# Altium schematic sheet 06_POWER.SchDoc
size A3
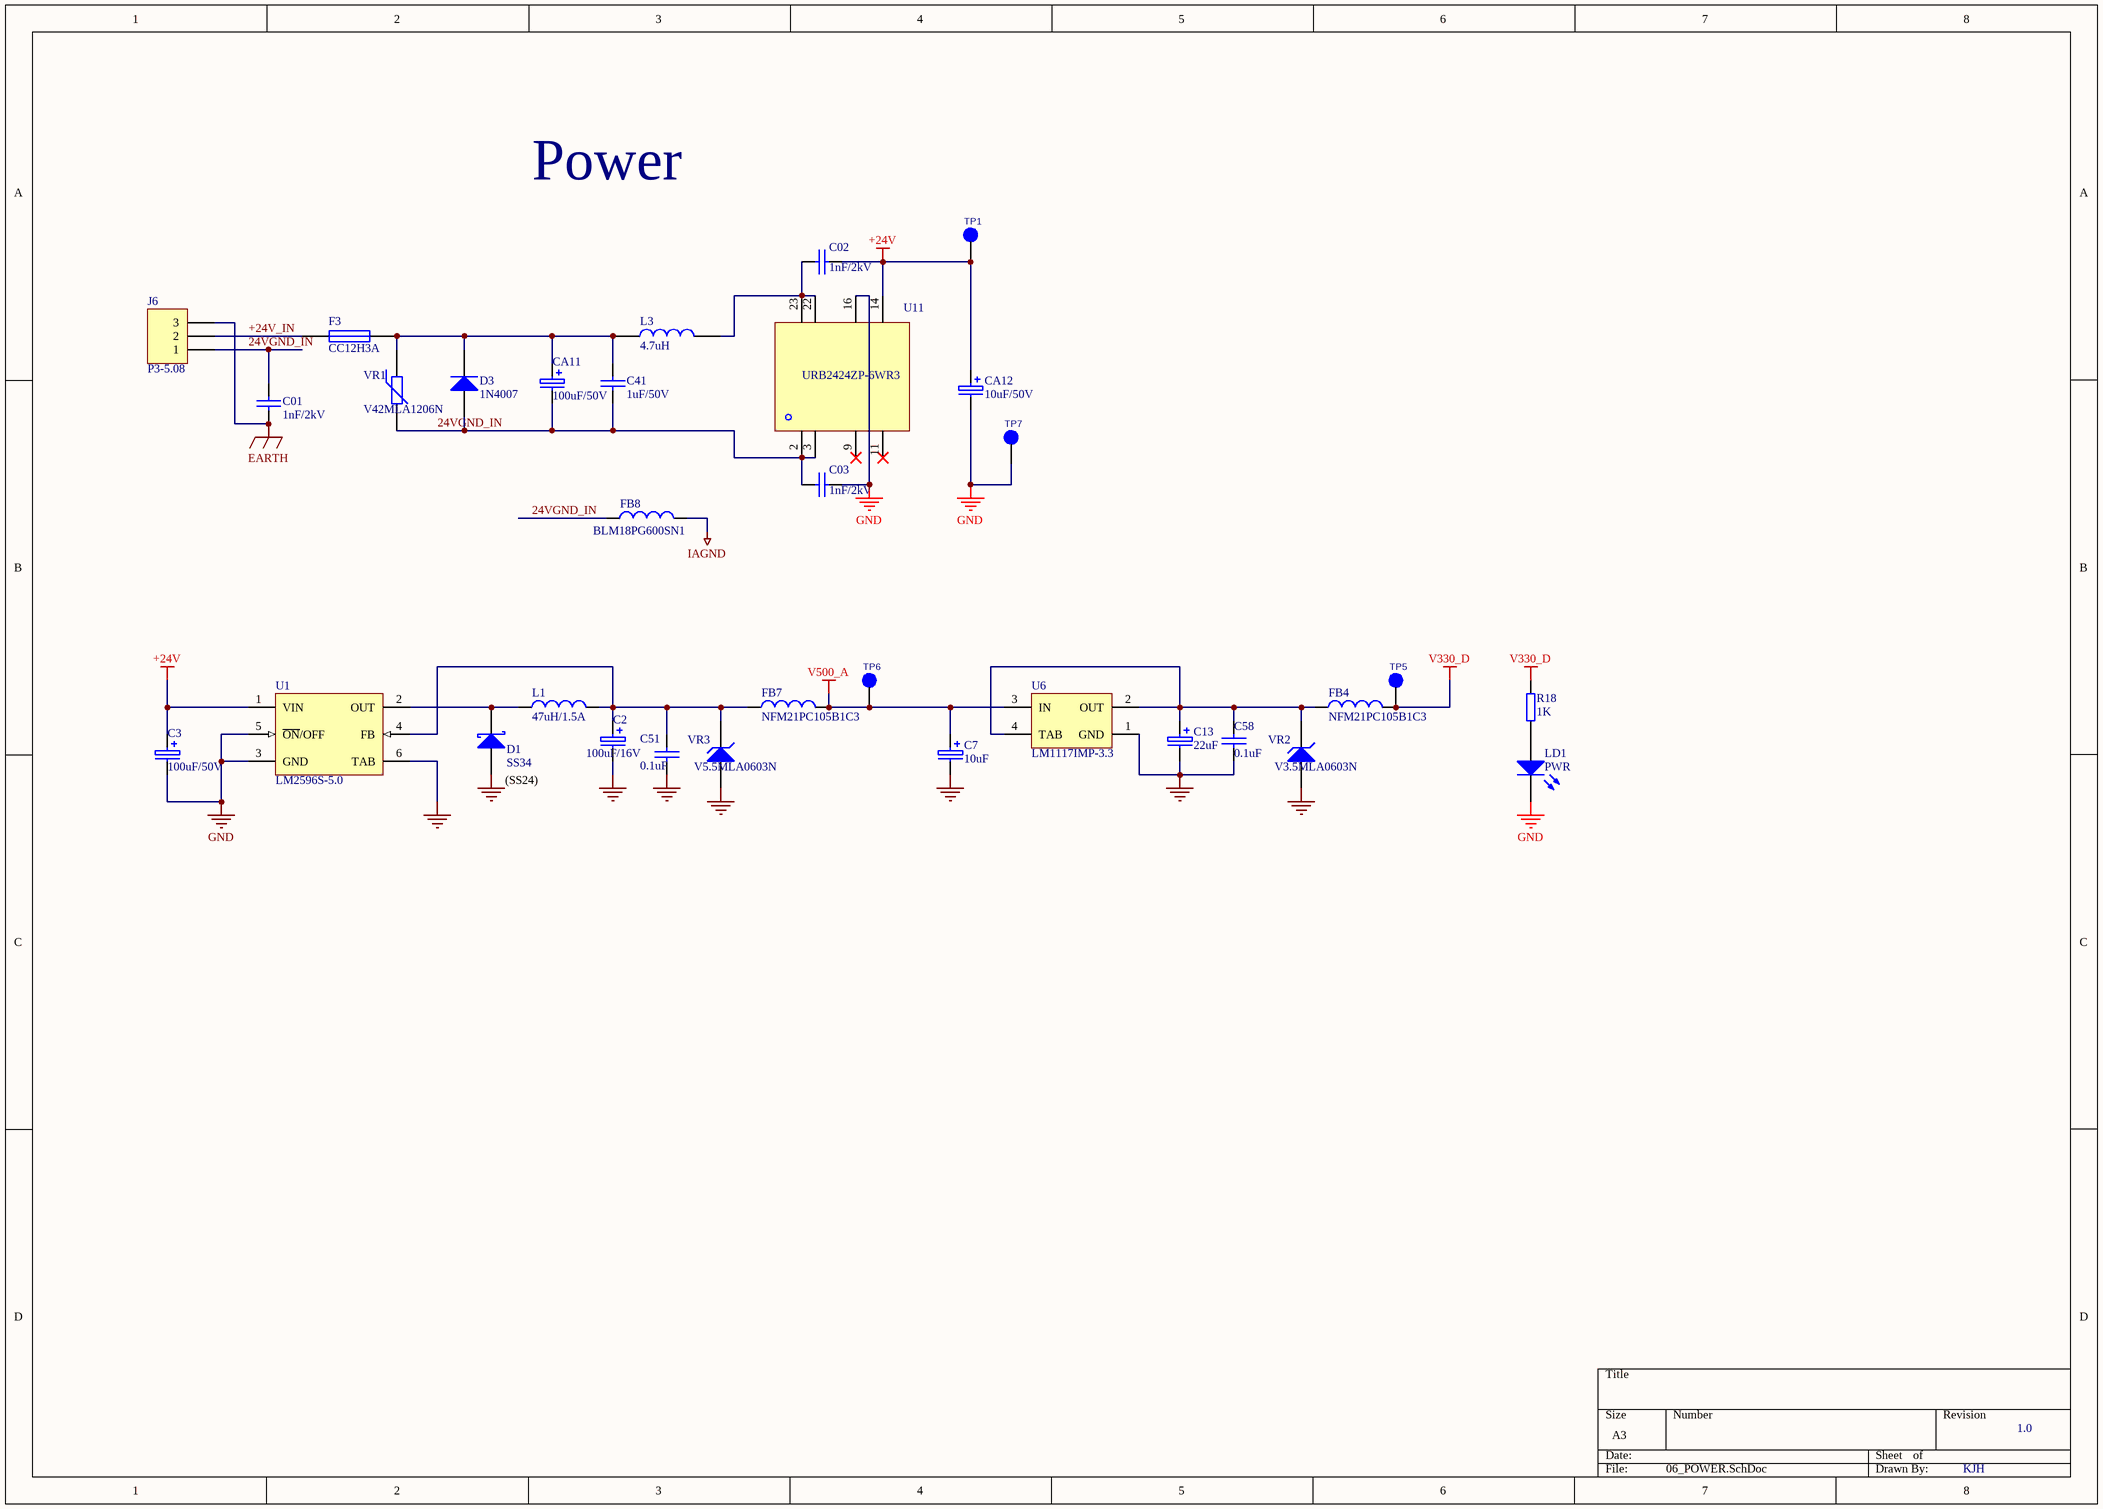
[diagram p0: 06_POWER.SchDoc]

## Parts
C01  1nF/2kV  [1206]
C02  1nF/2kV  [1206]
C2  100uF/16V  [D]
C03  1nF/2kV  [1206]
C3  100uF/50V  [D]
C7  10uF  [1206C]
C13  22uF  [1206C]
C41  1uF/50V  [0805]
C51  0.1uF  [0603A]
C58  0.1uF  [0603]
CA11  100uF/50V  [D]
CA12  10uF/50V  [1206C]
D1  SS34  [ZD]
D3  1N4007  [1N4007]
F3  CC12H3A  [1812]
FB4  NFM21PC105B1C3  [NFM21PC105]
FB7  NFM21PC105B1C3  [NFM21PC105]
FB8  BLM18PG600SN1  [0603]
J6  P3-5.08  [PH3-5.08mm]
L1  47uH/1.5A  [1812]
L3  4.7uH  [LPS3010]
LD1  PWR  [LED]
R18  1K  [0603A]
TP1  P24V  [test point]  (value not drawn)
TP5  P3.3V  [test point]  (value not drawn)
TP6  P5V  [test point]  (value not drawn)
TP7  GND  [test point]  (value not drawn)
U1  LM2596S-5.0  [TS5B_N]
U6  LM1117IMP-3.3  [MP04A_N]
U11  URB2424ZP-6WR3  [URB2424ZP-6WR3]
VR1  V42MLA1206N  [1206]
VR2  V3.5MLA0603N  [0603]
VR3  V5.5MLA0603N  [0603]

## Nets
+24V: C02.1 C3.1 CA12.1 TP1.1 U1.1(VIN) U11.14
EARTH: C01.2 J6.3
GND: C2.2 C03.1 C3.2 C7.2 C13.2 C51.2 C58.2 CA12.2 D1.1(A) LD1.2(K) TP7.1 U1.3(GND) U1.5(~{ON}/OFF) U1.6(TAB) U6.1(GND) U11.16 VR2.1(A) VR3.1(A)
IAGND: FB8.2
V330_D: FB4.2 R18.2 TP5.1
V500_A: C7.1 FB7.2 TP6.1 U6.3(IN)
24VGND_IN: C01.1 C03.2 C41.2 CA11.2 D3.1(A) FB8.1 J6.1 U11.2 U11.3 VR1.2
+24V_IN: F3.1 J6.2
NetC2_1: C2.1 C51.1 FB7.1 L1.2 U1.4(FB) VR3.2(K)
NetC02_2: C02.2 L3.2 U11.22 U11.23
NetC13_1: C13.1 C58.1 FB4.1 U6.2(OUT) U6.4(TAB) VR2.2(K)
NetC41_1: C41.1 CA11.1 D3.2(K) F3.2 L3.1 VR1.1
NetD1_2: D1.2(K) L1.1 U1.2(OUT)
NetLD1_1: LD1.1(A) R18.1

Not connected (* = marked no-connect by the designer): U11 9* 11*

## Notes on the sheet
- Power
- (near D1) (SS24)
- 1.0
- KJH

## Library data of the parts
C01 C02 C03 C41 C51 C58 = CAP: Capacitor
C2 C3 CA11 CA12 = CAPE: 极性电容
C7 C13 = C: 极性电容
D1 = D Schottky: Schottky Diode; Published: 8-Jun-2000; LatestRevisionDate: 17-Jul-2002; LatestRevisionNote: Re-released for DXP Platform.; PackageReference: SMB; Publisher: Altium Limited; PackageDescription: DO-214-AA/SMB; 2 C-Bend Leads; Body 5.3 x 3.6 mm, inc. leads (LxW); Code_JEDEC: DO-214-AA
D3 = Diode 1N4007: 1 Amp General Purpose Rectifier; Published: 8-Jun-2000; LatestRevisionDate: 17-Jul-2002; LatestRevisionNote: Re-released for DXP Platform.; DatasheetVersion: 1998; PackageVersion: Aug-1999; PackageReference: DO-41; Publisher: Altium Limited; PackageDescription: Diode, Axial; Body 5.2 x 2.7 mm (LxDia. max), Lead Dia. 0.86 mm (max); Code_JEDEC: DO-204-AL; ComponentLink1Description: Manufacturer Link; ComponentLink1URL: http://www.fairchildsemi.com/; ComponentLink2Description: Datasheet; ComponentLink2URL: http://www.fairchildsemi.com/ds/1N%2F1N4001.pdf
F3 = FUSE1: Fuse, 3A, 63Vdc
FB4 FB7 FB8 L1 = Inductor: Code_IEC: 1005; Value: 10mH; Published: 8-Jun-2000; LatestRevisionDate: 29-May-2009; LatestRevisionNote: IPC-7351 Footprint Added.; PackageReference: 0402-A; Publisher: Altium Limited; PackageDescription: Chip Inductor; Code_JEITA: 0402
J6 = Header 3: Header, 3-Pin; LatestRevisionDate: 17-Jul-2002; LatestRevisionNote: Re-released for DXP Platform.; Publisher: Altium Limited
L3 = INDUCTOR
LD1 = LED0: Typical INFRARED GaAs LED; Published: 8-Jun-2000; LatestRevisionDate: 08-Jul-2005; LatestRevisionNote: Mech Layer 1 removed.; PackageReference: LED-0; Publisher: Altium Limited; PackageDescription: LED; 2 Leads
R18 = RE: 电阻
TP1 TP5-TP7 = PAD
U1 = LM2596S-5.0: SIMPLE SWITCHER?Power Converter 150 KHz 3A Step-Down Voltage Regulator, 5-pin TO-263; Manufacturer: National Semiconductor; PackageTopMarking: NSUZXYTTE#*LM2596S*-5.0 P+; PowerWise: N; Published: 4-Dec-2008; DatasheetVersion: May-2002; PackageVersion: revD, Apr-2005; PackageReference: TS5B; Publisher: Altium Limited; PackageDescription: TO-263, Molded, .400 x .390 x .180in, 5 Lead, .067in Pitch, Surface Mount; Supplier 1: Farnell; Supplier Part Number 1: 1214546; PartNumber: LM2596S-5.0; RoHS: N; PinCount: 5; CompType: Switcher; Code_JEDEC: MO-169-AB; ComponentLink1Description: LM2596 Datasheet; ComponentLink1URL: http://www.national.com/ds/LM/LM2596.pdf; ComponentLink2Description: LM2596 Web Page; ComponentLink2URL: http://www.national.com/pf/LM/LM2596.html; ComponentLink3Description: TS5B Package Page; ComponentLink3URL: http://www.national.com/packaging/folders/ts5b.html
U6 = LM1117IMP-3.3: 800mA Low-Dropout Linear Regulator, 4-pin SOT-223; Manufacturer: National Semiconductor; PackageTopMarking: XYTT*N05B; PowerWise: N; CompType: LDO IC; Published: 4-Dec-2008; DatasheetVersion: Apr-2006; PackageVersion: revB, Apr-2003; PackageReference: MP04A; Publisher: Altium Limited; PackageDescription: Molded SOT-223, 6.50 x 3.56 x 1.6mm Body, 4 Lead, 2.3mm Pitch; Supplier 1: Farnell; Supplier Part Number 1: 7614123; PartNumber: LM1117IMP-3.3; RoHS: N; PinCount: 4; Code_JEDEC: TO-261-AA; Code_IPC: SOT223-4; ComponentLink1Description: LM1117 Datasheet; ComponentLink1URL: http://www.national.com/ds/LM/LM1117.pdf; ComponentLink2Description: LM1117 Web Page; ComponentLink2URL: http://www.national.com/pf/LM/LM1117.html; ComponentLink3Description: MP04A Package Page; ComponentLink3URL: http://www.national.com/packaging/folders/mp04a.html
VR1 = Res Varistor: Varistor (Voltage-Sensitive Resistor); Published: 24-Mar-1999; LatestRevisionDate: 29-May-2009; LatestRevisionNote: IPC-7351 Footprint Added.; PackageVersion: Mar-2003; PackageReference: 6-0805; Publisher: Altium Limited; PackageDescription: Chip Resistor 0805 Case Size; Code_IPC: RESC2012
VR2 VR3 = D Zener: Zener Diode; Published: 8-Jun-2000; LatestRevisionDate: 17-Jul-2002; LatestRevisionNote: Re-released for DXP Platform.; PackageReference: DIODE-0.7; Publisher: Altium Limited; PackageDescription: Diode, Thru-Hole; 2 Leads; 0.7 in Pin Spacing